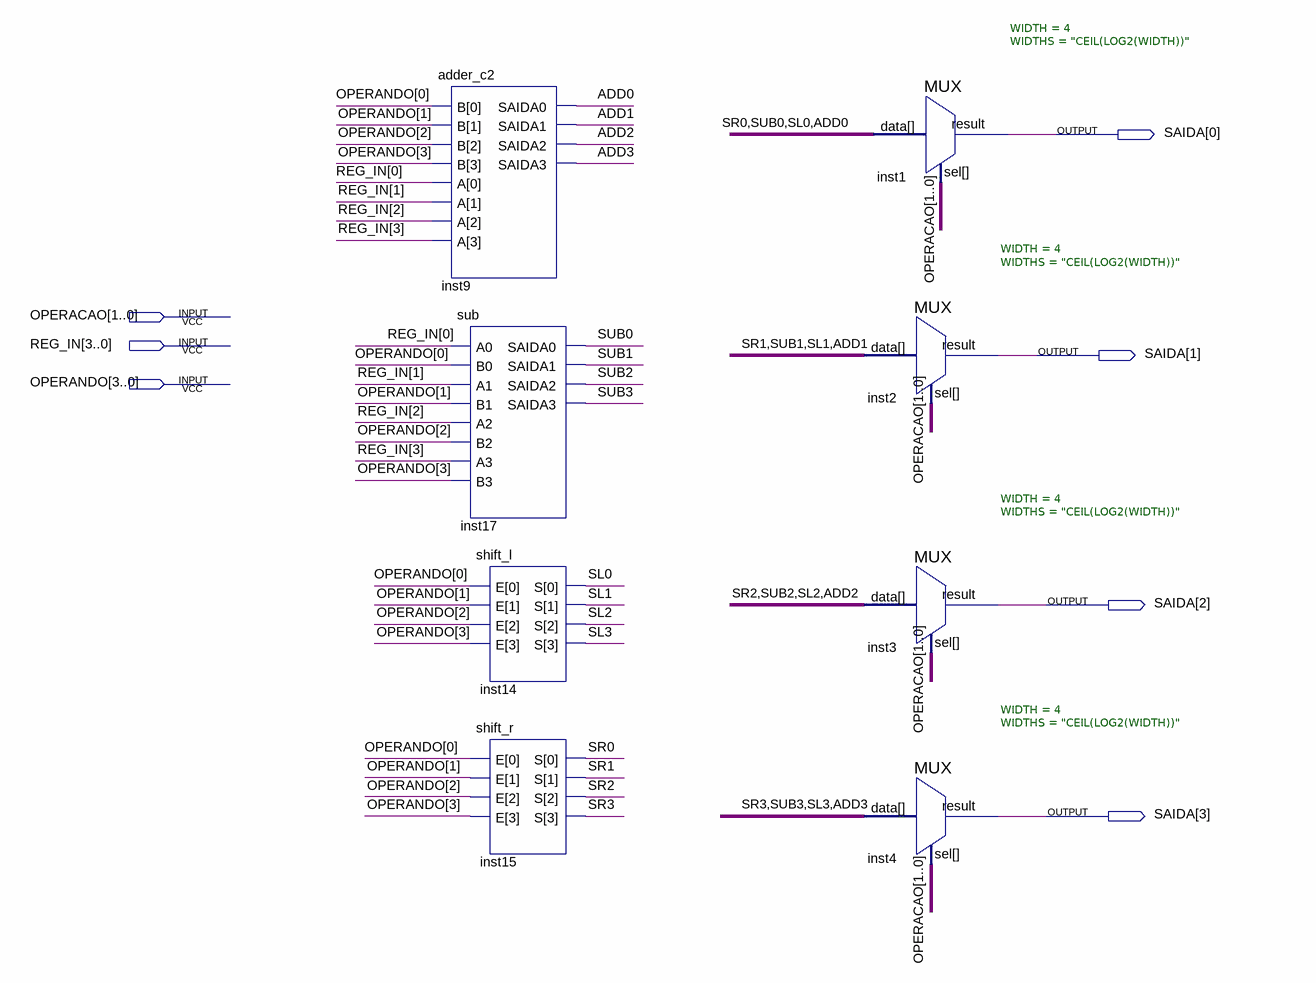
[diagram p0: schematic sheet]
// Quartus schematic ula.bdf as structural Verilog: 8 symbols, 7 pins
module ula (
  input  [1:0] OPERACAO,
  input  [3:0] REG_IN,
  input  [3:0] OPERANDO,
  output [3:0] SAIDA
);

  wire ADD0, ADD1, ADD2, ADD3, SL0, SL1, SL2, SL3, SR0, SR1, SR2, SR3, SUB0, SUB1, SUB2, SUB3;

  adder_c2 inst9 (.B(OPERANDO), .A(REG_IN), .SAIDA0(ADD0), .SAIDA1(ADD1), .SAIDA2(ADD2), .SAIDA3(ADD3));
  sub inst17 (
    .A0(REG_IN[0]), .B0(OPERANDO[0]), .A1(REG_IN[1]), .B1(OPERANDO[1]), .A2(REG_IN[2]), .B2(OPERANDO[2]),
    .A3(REG_IN[3]), .B3(OPERANDO[3]), .SAIDA0(SUB0), .SAIDA1(SUB1), .SAIDA2(SUB2), .SAIDA3(SUB3));
  shift_l inst14 (.E(OPERANDO), .S({SL3, SL2, SL1, SL0}));
  shift_r inst15 (.E(OPERANDO), .S({SR3, SR2, SR1, SR0}));
  MUX #(.WIDTH(4), .WIDTHS("CEIL(LOG2(WIDTH))")) inst1 (
    .data({SR0, SUB0, SL0, ADD0}), .sel(OPERACAO), .result(SAIDA[0]));
  MUX #(.WIDTH(4), .WIDTHS("CEIL(LOG2(WIDTH))")) inst2 (
    .data({SR1, SUB1, SL1, ADD1}), .sel(OPERACAO), .result(SAIDA[1]));
  MUX #(.WIDTH(4), .WIDTHS("CEIL(LOG2(WIDTH))")) inst3 (
    .data({SR2, SUB2, SL2, ADD2}), .sel(OPERACAO), .result(SAIDA[2]));
  MUX #(.WIDTH(4), .WIDTHS("CEIL(LOG2(WIDTH))")) inst4 (
    .data({SR3, SUB3, SL3, ADD3}), .sel(OPERACAO), .result(SAIDA[3]));
endmodule
